# Altium schematic sheet Main.SchDoc
size A3; SheetNumber: 1
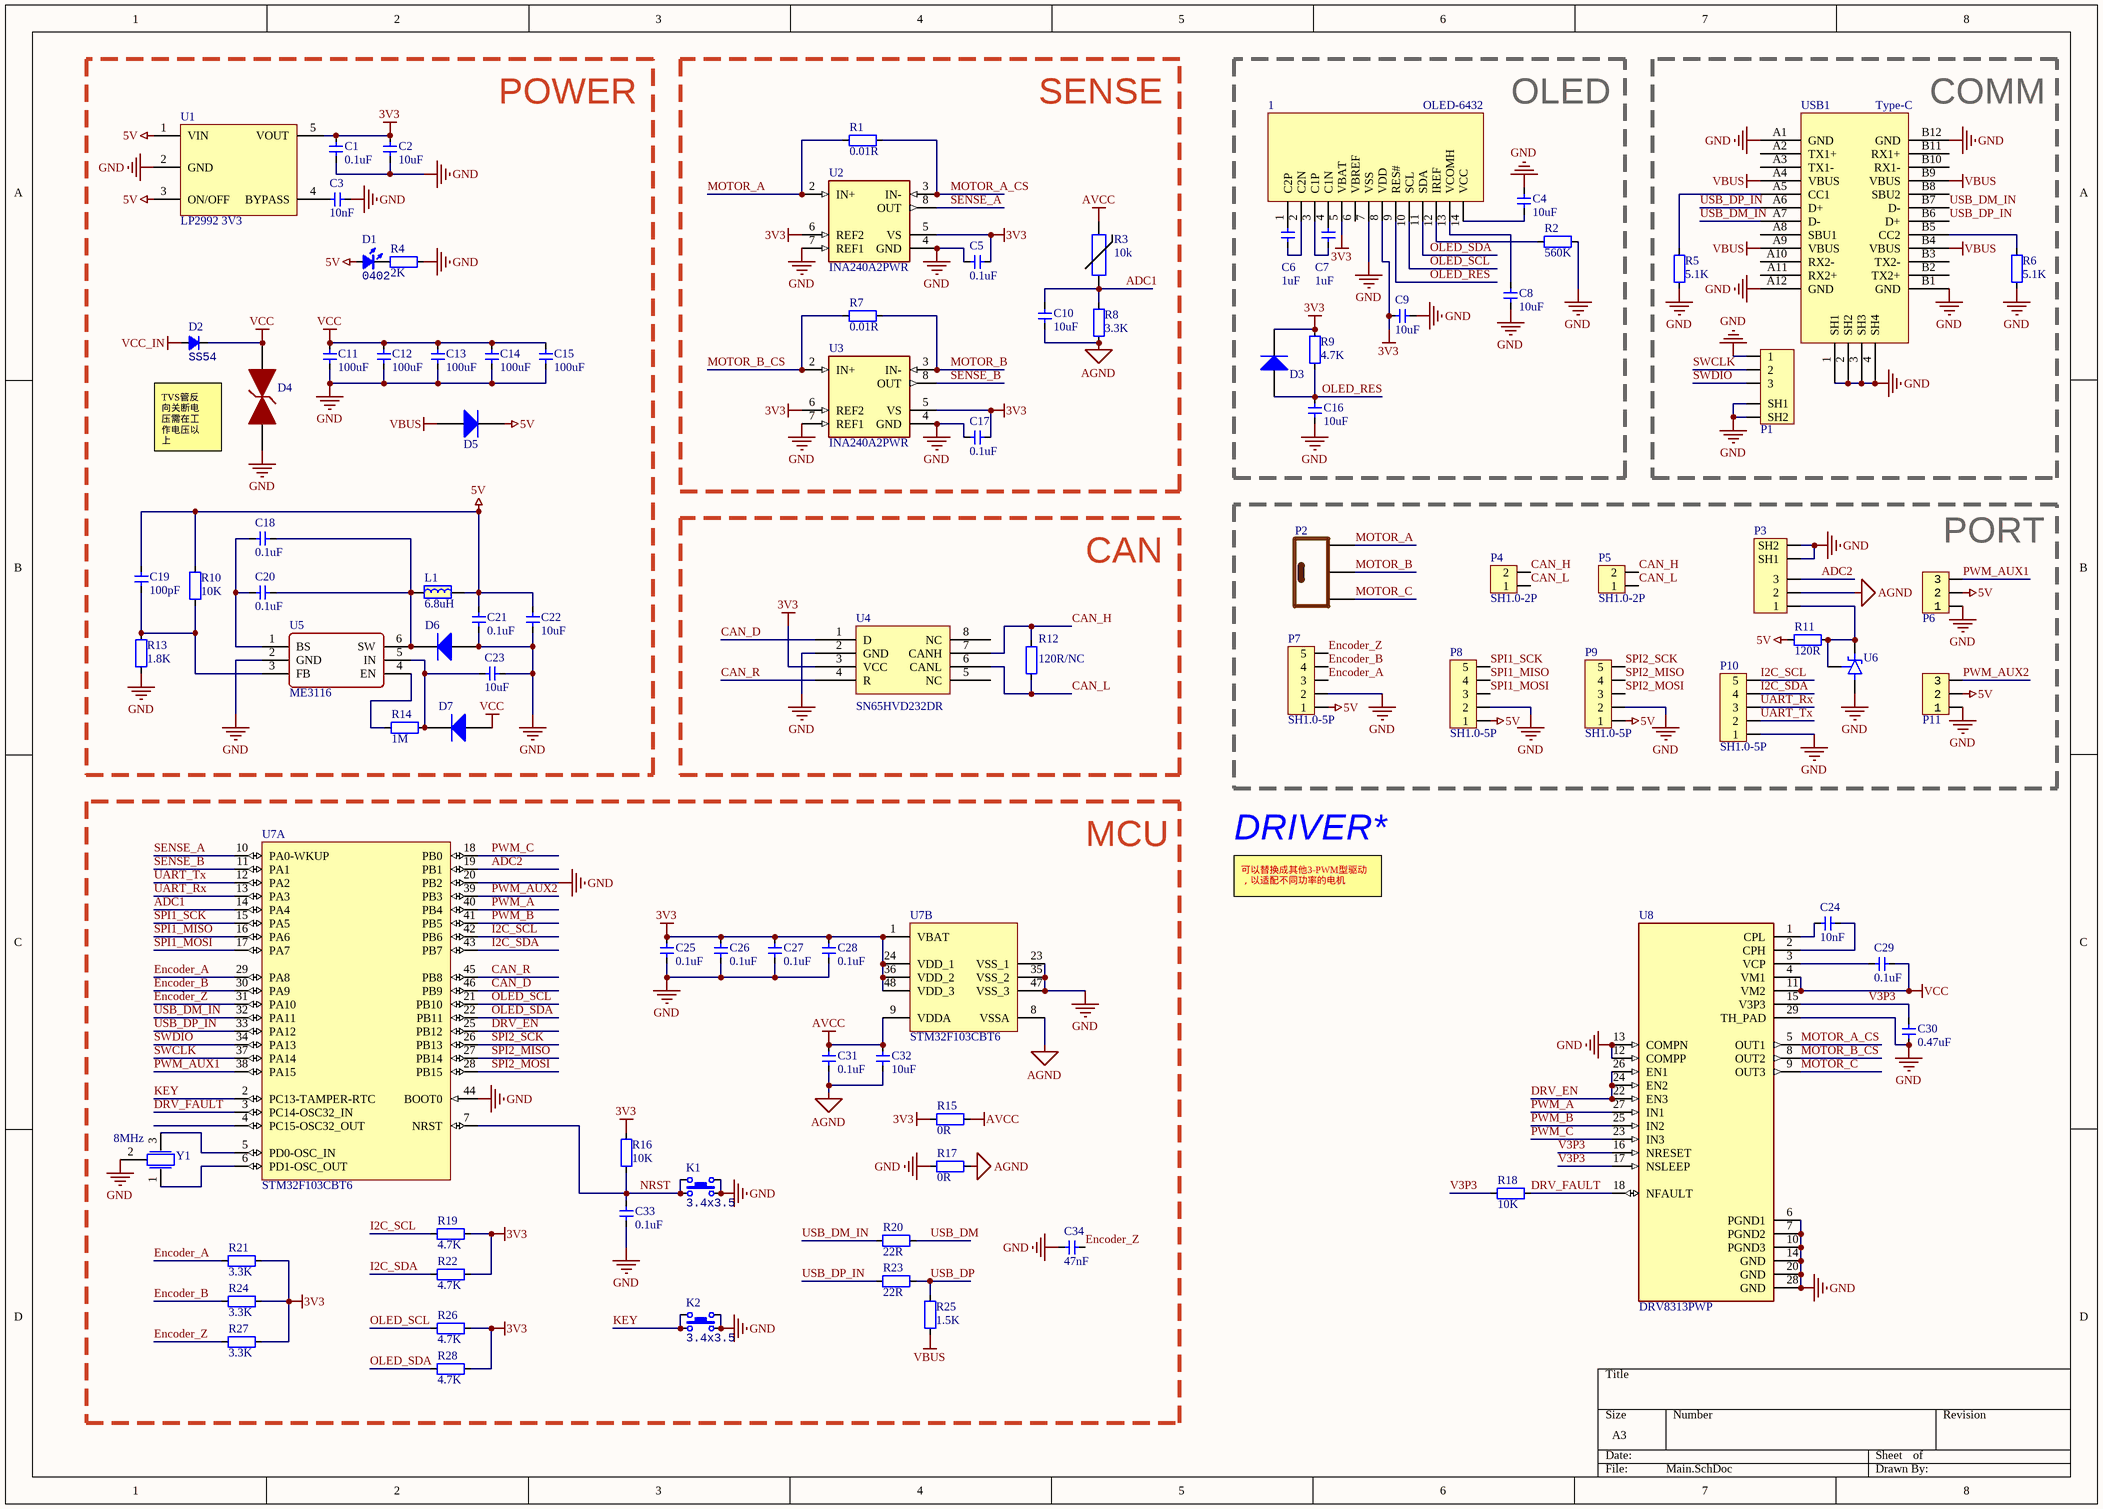
[diagram p0: Main.SchDoc]

## Parts
1  OLED-6432  [OLED-6432-TOP]
C1  0.1uF  [CAP_0402]
C2  10uF  [CAP_0402]
C3  10nF  [CAP_0402]
C4  10uF  [CAP_0402]
C5  0.1uF  [CAP_0402]
C6  1uF  [CAP_0402]
C7  1uF  [CAP_0402]
C8  10uF  [CAP_0402]
C9  10uF  [CAP_0402]
C10  10uF  [CAP_0402]
C11  100uF  [1206-CAP]
C12  100uF  [1206-CAP]
C13  100uF  [1206-CAP]
C14  100uF  [1206-CAP]
C15  100uF  [1206-CAP]
C16  10uF  [CAP_0402]
C17  0.1uF  [CAP_0402]
C18  0.1uF  [CAP_0402]
C19  100pF  [CAP_0402]
C20  0.1uF  [CAP_0402]
C21  0.1uF  [CAP_0402]
C22  10uF  [CAP_0402]
C23  10uF  [CAP_0402]
C24  10nF  [CAP_0402]
C25  0.1uF  [CAP_0402]
C26  0.1uF  [CAP_0402]
C27  0.1uF  [CAP_0402]
C28  0.1uF  [CAP_0402]
C29  0.1uF  [CAP_0402]
C30  0.47uF  [CAP_0402]
C31  0.1uF  [CAP_0402]
C32  10uF  [CAP_0402]
C33  0.1uF  [CAP_0402]
C34  47nF  [CAP_0402]
D1  Type: 0402  [LED_0402_RED]  (hidden comment: color?)
D2  SS54  [DO-214AC]
D3  二极管-5B5817WS  [SOD-323]  (value not drawn)
D4  SMBJ28CA  [SMBJ-CA_MFG]  (value not drawn)
D5  二极管-5B5819WS  [SOD-323]  (value not drawn)
D6  二极管-5B5819WS  [SOD-323]  (value not drawn)
D7  二极管-5B5819WS  [SOD-323]  (value not drawn)
K1  value 3.4x3.5  [ButtonTACT_3.5*3.55_90]  (hidden comment: TACT 4P)
K2  value 3.4x3.5  [ButtonTACT_3.5*3.55_90]  (hidden comment: TACT 4P)
L1  6.8uH  [IND-201612]
P1  SH1.0-3P  [SH1.0-3P]  (value not drawn)
P2  电机接插件-3P  [AMASS-MR30-M]  (value not drawn)
P3  SH1.0-3P  [SH1.0-3P]  (value not drawn)
P4  SH1.0-2P  [SH1.0-2P]
P5  SH1.0-2P  [SH1.0-2P]
P6  HDR1x3_2.54  [HDR1X3_2.54_180]  (value not drawn)
P7  SH1.0-5P  [SH1.0-5P]
P8  SH1.0-5P  [SH1.0-5P]
P9  SH1.0-5P  [SH1.0-5P]
P10  SH1.0-5P  [SH1.0-5P]
P11  HDR1x3_2.54  [HDR1X3_2.54_180]  (value not drawn)
R1  0.01R  [1206-RES]
R2  560K  [RES_0402]
R3  value 10k  [RES_0402]  (hidden comment: NCP15XH103F03RC)
R4  2K  [RES_0402]
R5  5.1K  [RES_0402]
R6  5.1K  [RES_0402]
R7  0.01R  [1206-RES]
R8  3.3K  [RES_0402]
R9  4.7K  [RES_0402]
R10  10K  [RES_0402]
R11  120R  [RES_0402]
R12  120R/NC  [RES_0402]
R13  1.8K  [RES_0402]
R14  1M  [RES_0402]
R15  0R  [RES_0402]
R16  10K  [RES_0402]
R17  0R  [RES_0402]
R18  10K  [RES_0402]
R19  4.7K  [RES_0402]
R20  22R  [RES_0402]
R21  3.3K  [RES_0402]
R22  4.7K  [RES_0402]
R23  22R  [RES_0402]
R24  3.3K  [RES_0402]
R25  1.5K  [RES_0402]
R26  4.7K  [RES_0402]
R27  3.3K  [RES_0402]
R28  4.7K  [RES_0402]
U1  LP2992 3V3  [SOT23-5]
U2  INA240A2PWR  [SOP65 P640X120-8N]
U3  INA240A2PWR  [SOP65 P640X120-8N]
U4  Manufacturer Part Number: SN65HVD232DR  [SO-8]  (hidden comment: SN65HVD232D)
U5  ME3116  [SOT23-6]
U6  TL431IDBZT  [SOT23-3]  (value not drawn)
U7  STM32F103CBT6  [LQFP-48]  (parts A,B of 2)
U8  DRV8313PWP  [HTSSOP-28]
USB1  Type-C  [Type-C-TOP]
Y1  8MHz  [晶振-3P]

## Blocks framed on the sheet
POWER: C1-C3 C11-C15 C18-C23 D1 D2 D4-D7 L1 R4 R10 R13 R14 U1 U5
SENSE: C5 C10 C17 R1 R3 R7 R8 U2 U3
OLED: 1 C4 C6-C9 C16 D3 R2 R9
COMM: P1 R5 R6 USB1
CAN: R12 U4
PORT: P2-P11 R11 U6
MCU: C25-C28 C31-C34 K1 K2 R15-R17 R19-R28 U7 Y1

## Nets
3V3: 1.5(VBAT) 1.8(VDD) C1.2 C2.2 C5.1 C9.2 C17.1 C25.2 C26.2 C27.2 C28.2 D3.2(K) R9.1 R15.2 R16.2 R19.2 R21.1 R22.2 R24.1 R26.2 R27.1 R28.2 U1.5(VOUT) U2.5(VS) U2.6(REF2) U3.5(VS) U3.6(REF2) U4.3(VCC) U7.1(VBAT) U7.24(VDD_1) U7.36(VDD_2) U7.48(VDD_3)
5V: C19.1 C21.2 C22.2 D1.1(A) D5.2(K) L1.2 P6.2 P7.1 P8.1 P9.1 P11.2 R10.2 R11.1 U1.1(VIN) U1.3(ON/OFF)
AGND: C10.1 C31.1 C32.1 P3.2 R8.1 R17.1 U7.8(VSSA)
AVCC: C31.2 C32.2 R3.2 R15.1 U7.9(VDDA)
GND: 1.7(VSS) C1.1 C2.1 C3.1 C4.1 C5.2 C8.1 C9.1 C11.1 C12.1 C13.1 C14.1 C15.1 C16.1 C17.2 C21.1 C22.1 C23.1 C25.1 C26.1 C27.1 C28.1 C30.1 C33.1 C34.2 D4.1 D6.1(A) K1.2 K1.4 K2.2 K2.4 P1.1 P1.SH1 P1.SH2 P3.SH1 P3.SH2 P6.1 P7.2 P8.2 P9.2 P10.1 P11.1 R2.1 R4.1 R5.2 R6.2 R13.1 R17.2 U1.2(GND) U2.4(GND) U2.7(REF1) U3.4(GND) U3.7(REF1) U4.2(GND) U5.2(GND) U6.3(ANODE) U7.20(PB2) U7.23(VSS_1) U7.35(VSS_2) U7.44(BOOT0) U7.47(VSS_3) U8.6(PGND1) U8.7(PGND2) U8.10(PGND3) U8.12(COMPP) U8.13(COMPN) U8.14(GND) U8.20(GND) U8.28(GND) U8.29(TH_PAD) USB1.1(SH1) USB1.2(SH2) USB1.3(SH3) USB1.4(SH4) USB1.A1(GND) USB1.A12(GND) USB1.B1(GND) USB1.B12(GND) Y1.2
VBUS: D5.1(A) R25.2 USB1.A4(VBUS) USB1.A9(VBUS) USB1.B4(VBUS) USB1.B9(VBUS)
VCC: C11.2 C12.2 C13.2 C14.2 C15.2 C29.2 D2.2(K) D4.2 D7.1(A) U8.4(VM1) U8.11(VM2)
VCC_IN: D2.1(A)
ADC1: C10.2 R3.1 R8.2 U7.14(PA4)
ADC2: P3.3 U7.19(PB1)
CAN_D: U4.1(D) U7.46(PB9)
CAN_H: P4.2 P5.2 R12.1 U4.7(CANH)
CAN_L: P4.1 P5.1 R12.2 U4.6(CANL)
CAN_R: U4.4(R) U7.45(PB8)
DRV_EN: U7.25(PB12) U8.22(EN3) U8.24(EN2) U8.26(EN1)
DRV_FAULT: R18.2 U7.3(PC14-OSC32_IN) U8.18(NFAULT)
Encoder_A: P7.3 R21.2 U7.29(PA8)
Encoder_B: P7.4 R24.2 U7.30(PA9)
Encoder_Z: C34.1 P7.5 R27.2 U7.31(PA10)
I2C_SCL: P10.5 R19.1 U7.42(PB6)
I2C_SDA: P10.4 R22.1 U7.43(PB7)
KEY: K2.1 K2.3 U7.2(PC13-TAMPER-RTC)
MOTOR_A: P2.3 R1.1 U2.2(IN+)
MOTOR_A_CS: R1.2 U2.3(IN-) U8.5(OUT1)
MOTOR_B: P2.2 R7.2 U3.3(IN-)
MOTOR_B_CS: R7.1 U3.2(IN+) U8.8(OUT2)
MOTOR_C: P2.1 U8.9(OUT3)
NRST: C33.2 K1.1 K1.3 R16.1 U7.7(NRST)
OLED_RES: 1.9(RES#) C16.2 D3.1(A) R9.2
OLED_SCL: 1.10(SCL) R26.1 U7.21(PB10)
OLED_SDA: 1.11(SDA) R28.1 U7.22(PB11)
PWM_A: U7.40(PB4) U8.27(IN1)
PWM_AUX1: P6.3 U7.38(PA15)
PWM_AUX2: P11.3 U7.39(PB3)
PWM_B: U7.41(PB5) U8.25(IN2)
PWM_C: U7.18(PB0) U8.23(IN3)
SENSE_A: U2.8(OUT) U7.10(PA0-WKUP)
SENSE_B: U3.8(OUT) U7.11(PA1)
SPI1_MISO: P8.4 U7.16(PA6)
SPI1_MOSI: P8.3 U7.17(PA7)
SPI1_SCK: P8.5 U7.15(PA5)
SPI2_MISO: P9.4 U7.27(PB14)
SPI2_MOSI: P9.3 U7.28(PB15)
SPI2_SCK: P9.5 U7.26(PB13)
SWCLK: P1.2 U7.37(PA14)
SWDIO: P1.3 U7.34(PA13)
UART_Rx: P10.3 U7.13(PA3)
UART_Tx: P10.2 U7.12(PA2)
USB_DM: R20.1
USB_DM_IN: R20.2 U7.32(PA11) USB1.A7(D-) USB1.B7(D-)
USB_DP: R23.1 R25.1
USB_DP_IN: R23.2 U7.33(PA12) USB1.A6(D+) USB1.B6(D+)
V3P3: C30.2 R18.1 U8.15(V3P3) U8.16(NRESET) U8.17(NSLEEP)
Net1_1: 1.1(C2P) C6.2
Net1_2: 1.2(C2N) C6.1
Net1_3: 1.3(C1P) C7.1
Net1_4: 1.4(C1N) C7.2
Net1_12: 1.12(IREF) R2.2
Net1_13: 1.13(VCOMH) C8.2
Net1_14: 1.14(VCC) C4.2
NetC3_2: C3.2 U1.4(BYPASS)
NetC18_1: C18.1 C20.1 D6.2(K) L1.1 U5.6(SW)
NetC18_2: C18.2 C20.2 U5.1(BS)
NetC19_2: C19.2 R10.1 R13.2 U5.3(FB)
NetC23_2: C23.2 D7.2(K) R14.1 U5.5(IN)
NetC24_1: C24.1 U8.1(CPL)
NetC24_2: C24.2 U8.2(CPH)
NetC29_1: C29.1 U8.3(VCP)
NetD1_2: D1.2(K) R4.2
NetP3_1: P3.1 R11.2 U6.1(CATHODE) U6.2(REF)
NetR5_1: R5.1 USB1.A5(CC1)
NetR6_1: R6.1 USB1.B5(CC2)
NetR14_2: R14.2 U5.4(EN)
NetU7_5: U7.5(PD0-OSC_IN) Y1.3
NetU7_6: U7.6(PD1-OSC_OUT) Y1.1

Not connected (* = marked no-connect by the designer): 1 6(VBREF); U4 5(NC) 8(NC); U7 4(PC15-OSC32_OUT); USB1 A2(TX1+) A3(TX1-) A8(SBU1) A10(RX2-) A11(RX2+) B2(TX2+) B3(TX2-) B8(SBU2) B10(RX1-) B11(RX1+)

## Notes on the sheet
- TVS管反
  向关断电
  压需在工
  作电压以
  上
- DRIVER*
- 可以替换成其他3-PWM型驱动，以适配不同功率的电机

## Library data of the parts
1 = OLED-6432: 显示屏
C1-C10 C16-C34 = 电容-0402: Capacitor; Value: 0.1u
C11-C15 = 电容-1206: Capacitor; Value: 0.1u
D1 = LED_0402: LED; Value: color?
D2 = Diode_SMA: Diode; Type: SMA; Value: SS54
D3 D5-D7 = 二极管-5B5817WS: 40V
K1 K2 = ButtonTACT: Button; type: TACT 4P
L1 = 电感-201612
P1 P3 = SH1.0-3P: Header
P2 = 电机接插件-3P: AMASS MR30
P6 P11 = HDR1x3_2.54: Header
R1 R7 = 电阻-1206: Resistor; Value: 22R
R2 R4-R6 R8-R19 R21 R22 R24-R28 = 电阻-0402: Resistor; Value: 22R
R3 = NCP15XH103F03RC: THERMISTOR 10K OHM NTC 0402 SMD
R20 R23 = 电阻-0402: Resistor; Value: 22R
U1 = LP2992: LDO
U2 U3 = INA240A2PWR: -4 to 80V, bidirectional, ultra-precise current sense amplifier with enhanced PWM rejection 8-TSSOP -40 to 125; MF: Texas Instruments; MP: INA240A2PWR; Value: *; Package: TSSOP-8 Texas Instruments; Price: None; Availability: Good; Purchase-URL: https://pricing.snapeda.com/search/part/INA240A2PWR/?ref=eda; SnapEDA_Link: https://www.snapeda.com/parts/INA240A2PWR/Texas%20Instruments/view-part/588604/?ref=snap
U4 = SN65HVD232D: Manufacturer: Texas Instruments; Protocol: CAN; Number of Drivers/Receivers: 1/1; Duplex: Half; Data Rate: 1Mbps; Voltage - Supply: 3 V ~ 3.6 V; Supplier 1: Digi-Key; Supplier Part Number 1: 296-26344-2-ND; RoHS: RoHS Compliant; Category: Integrated Circuits (ICs); Stock: 5000; Pricing 1: 2500=0.84375 (USD); Packaging: Tape & Reel (TR); Part Status: Active; Type: Transceiver; Operating Temperature: -40°C ~ 85°C; Mounting Type: Surface Mount; Package / Case: 8-SOIC (0.154", 3.90mm Width); Supplier Device Package: 8-SOIC; ComponentLink1URL: http://www.ti.com/lit/ds/symlink/sn65hvd230.pdf; ComponentLink1Description: http://www.ti.com/lit/ds/symlink/sn65hvd230.pdf; Supplier 2: Digi-Key; Supplier Part Number 2: 296-26344-1-ND; Pricing 2: 1=2.05, 10=1.842, 100=1.4809, 500=1.21668, 1000=1.00811 (USD)
U5 = ME3116: DC-DC
U6 = TL431IDBZT: Adjustable precision shunt regulator 3-SOT-23 -40 to 85; MF: Texas Instruments; Price: None; Package: SOT-23-3 Texas Instruments; Check_prices: https://www.snapeda.com/parts/TL431IDBZT/Texas%20Instruments/view-part/1206577/?ref=eda; Availability: Warning; MP: TL431IDBZT; Value: *; SnapEDA_Link: https://www.snapeda.com/parts/TL431IDBZT/Texas%20Instruments/view-part/1206577/?ref=snap; Purchase-URL: https://pricing.snapeda.com/search/part/TL431IDBZT/?ref=eda
U7 = STM32F103CBT6: ARM Cortex-M3 32-bit MCU, 128 KB Flash, 20 KB Internal RAM, 37 I/Os, 48-pin LQFP, -40 to 85 degC, Tray; A/D Converter: 2x12-bit (10 Channel); FLASH Size (Prog) (kB): 128; I/Os (High Current): 37; Internal RAM Size (kB): 20; Operating Frequency(F) (Processor speed) (MHz): 72; Supply Voltage(Vcc) min (V): 2; DatasheetVersion: Rev. 16; PackageVersion: Rev. 6, 06/2013; PackageReference: LQFP48; PackageDescription: 48-Pin Low Profile Quad Flat Package, 7 x 7 mm Body, 0.5 mm Pitch; Supplier 1: Digi-Key; Supplier Part Number 1: 497-6288-ND; Supplier 2: Farnell; Supplier Part Number 2: 1606327; Supplier 3: Newark; Supplier Part Number 3: 11N8296; Supplier 4: Newark; Supplier Part Number 4: 57P1214; Supplier 5: Mouser; Supplier Part Number 5: 511-STM32F103CBT6; Core: ARM Cortex-M3; Packing: Tray; Mounting Technology: Surface Mount; PartNumber: STM32F103CBT6; ComponentLink1Description: Manufacturer URL; ComponentLink1URL: http://www.st.com/web/en/home.html; ComponentLink2Description: Datasheet; ComponentLink2URL: http://www.st.com/st-web-ui/static/active/en/resource/technical/document/datasheet/CD00161566.pdf; ComponentLink3Description: Package Specification; ComponentLink3URL: http://www.st.com/st-web-ui/static/active/en/resource/technical/document/datasheet/DM00058181.pdf
U8 = DRV8313PWP: 65-V max, 3-A peak 3-phase motor driver 28-HTSSOP -40 to 125; MF: Texas Instruments; Availability: Good; SnapEDA_Link: https://www.snapeda.com/parts/DRV8313PWP/Texas%20Instruments/view-part/287728/?ref=snap; Price: None; MP: DRV8313PWP; Purchase-URL: https://pricing.snapeda.com/search/part/DRV8313PWP/?ref=eda; Package: HTSSOP-28 Texas Instruments; Value: *
USB1 = USB-Type-C-TOP
Y1 = 晶振-3Pin: 村田贴片